# EAGLE design E-meter2 (EAGLE 7.4.0)
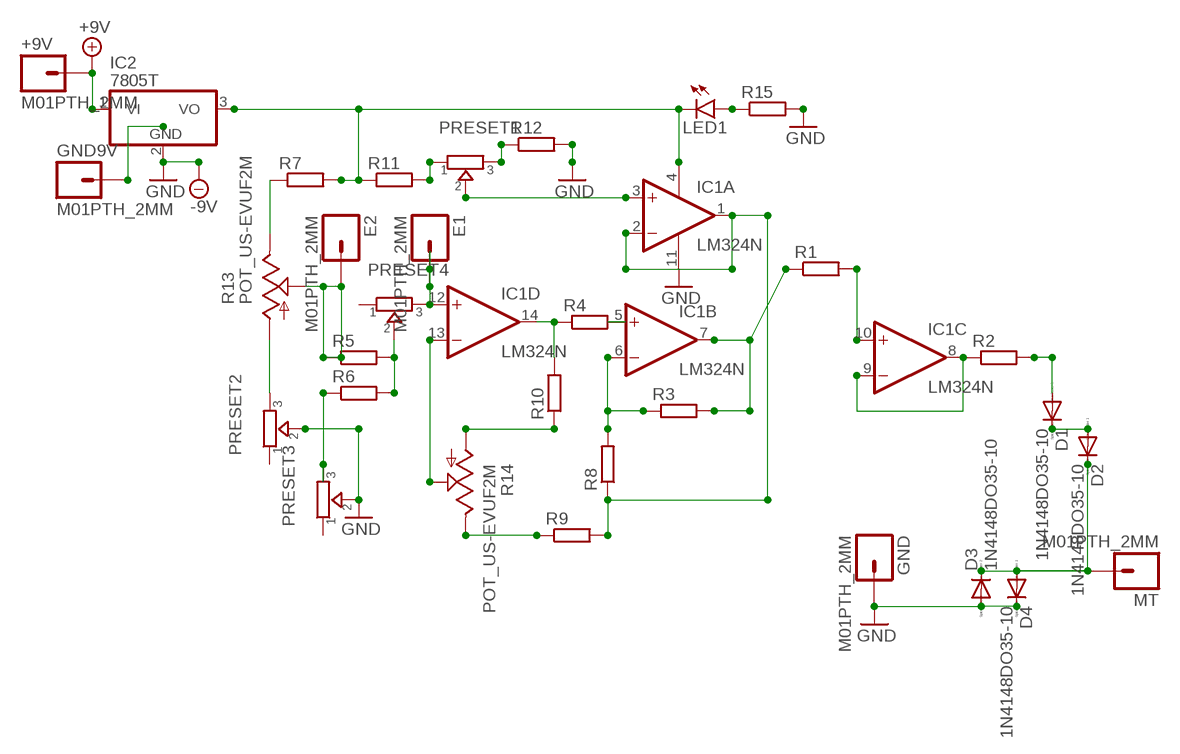
[diagram p0: schematic, sheet 1]

## Parts
+9V  M01PTH_2MM  [1X01_2MM]
D1  1N4148DO35-10  [DO35-10]
D2  1N4148DO35-10  [DO35-10]
D3  1N4148DO35-10  [DO35-10]
D4  1N4148DO35-10  [DO35-10]
E1  M01PTH_2MM  [1X01_2MM]
E2  M01PTH_2MM  [1X01_2MM]
GND  M01PTH_2MM  [1X01_2MM]
GND9V  M01PTH_2MM  [1X01_2MM]
IC1  LM324N  [DIL14]
IC2  7805T  [TO220H]
LED1  LED5MM  [LED5MM]
MT  M01PTH_2MM  [1X01_2MM]
PRESET1  TRIMMER-3306F  [TRIMMER_3306F]
PRESET2  TRIMMER-3306F  [TRIMMER_3306F]
PRESET3  TRIMMER-3306F  [TRIMMER_3306F]
PRESET4  TRIMMER-3306F  [TRIMMER_3306F]
R1  R-EU_0207/10  [0207/10]
R2  R-EU_0207/10  [0207/10]
R3  R-EU_0207/10  [0207/10]
R4  R-EU_0207/10  [0207/10]
R5  R-EU_0207/10  [0207/10]
R6  R-EU_0207/10  [0207/10]
R7  R-EU_0207/10  [0207/10]
R8  R-EU_0207/10  [0207/10]
R9  R-EU_0207/10  [0207/10]
R10  R-EU_0207/10  [0207/10]
R11  R-EU_0207/10  [0207/10]
R12  R-EU_0207/10  [0207/10]
R13  POT_US-EVUF2M  [POT_EVUFXM]
R14  POT_US-EVUF2M  [POT_EVUFXM]
R15  R-EU_0207/10  [0207/10]

## Nets
+9V: +9V.1 IC2.1(VI)
GND: D3.A D4.C GND.1 IC1.11(P:V-) IC2.2(GND) PRESET2.2 PRESET3.2 R12.2 R15.2 ; supply symbol labelled -9V
N$1: E2.1 R5.1 R13.2(S)
N$2: IC1.10(C:+IN) R1.2
N$3: IC1.6(B:-IN) R3.1 R8.2
N$4: IC1.1(A:OUT) IC1.2(A:-IN) R8.1 R9.2
N$5: IC1.5(B:+IN) R4.2
N$6: IC1.14(D:OUT) R4.1 R10.2
N$7: IC1.8(C:OUT) IC1.9(C:-IN) R2.1
N$8: D1.A R2.2
N$9: E1.1 IC1.12(D:+IN) PRESET4.3
N$10: D1.C D2.A
N$11: D2.C D3.C D4.A MT.1
N$12: IC1.3(A:+IN) PRESET1.2
N$13: PRESET1.1 R11.2
N$14: IC1.4(P:V+) IC2.3(VO) LED1.K(C) R7.2 R11.1
N$15: R7.1 R13.3(E)
N$16: PRESET1.3 R12.1
N$17: R10.1 R14.1(A)
N$18: GND9V.1
N$19: PRESET2.3 R13.1(A)
N$20: IC1.13(D:-IN) R14.2(S)
N$21: R9.1 R14.3(E)
N$22: IC1.7(B:OUT) R1.1 R3.2
N$23: PRESET4.2 R5.2 R6.2
N$24: PRESET3.3 R6.1
N$26: LED1.A R15.1
Unconnected: PRESET2.1 PRESET3.1 PRESET4.1

## Library data of the parts
+9V E1 E2 GND GND9V MT = SparkFun-Connectors:M01: Header 1 Standard 1-pin 0.1" header. Use with straight break away headers (SKU : PRT-00116), right angle break away headers (PRT-00553), swiss pins (PRT-00743), machine pins (PRT-00117), and female headers (PRT-00115).
D1-D4 = studioalgorhythmics_parts:1N4148: DIODE high speed (Philips)
IC1 = studioalgorhythmics_parts:LM324: OP AMP
IC2 = linear:78*: Positive VOLTAGE REGULATOR Source: http://cache.national.com/ds/LM/LM78L05.pdf http://www.fairchildsemi.com/ds/LM/LM7805.pdf
LED1 = studioalgorhythmics_parts:LED: LEDs Standard schematic elements and footprints for 5mm, 3mm, 1206, and 0603 sized LEDs. 5mm - Spark Fun Electronics SKU : COM-00529 (and others)
PRESET1-PRESET4 = studioalgorhythmics_parts:TRIMMER: Trimmer resistor
R1-R12 R15 = studioalgorhythmics_parts:R-EU_: RESISTOR, European symbol
R13 R14 = studioalgorhythmics_parts:POT_US-EVU: 9 mm Square Rotary Potentiometers Source: Panasonic

## Board
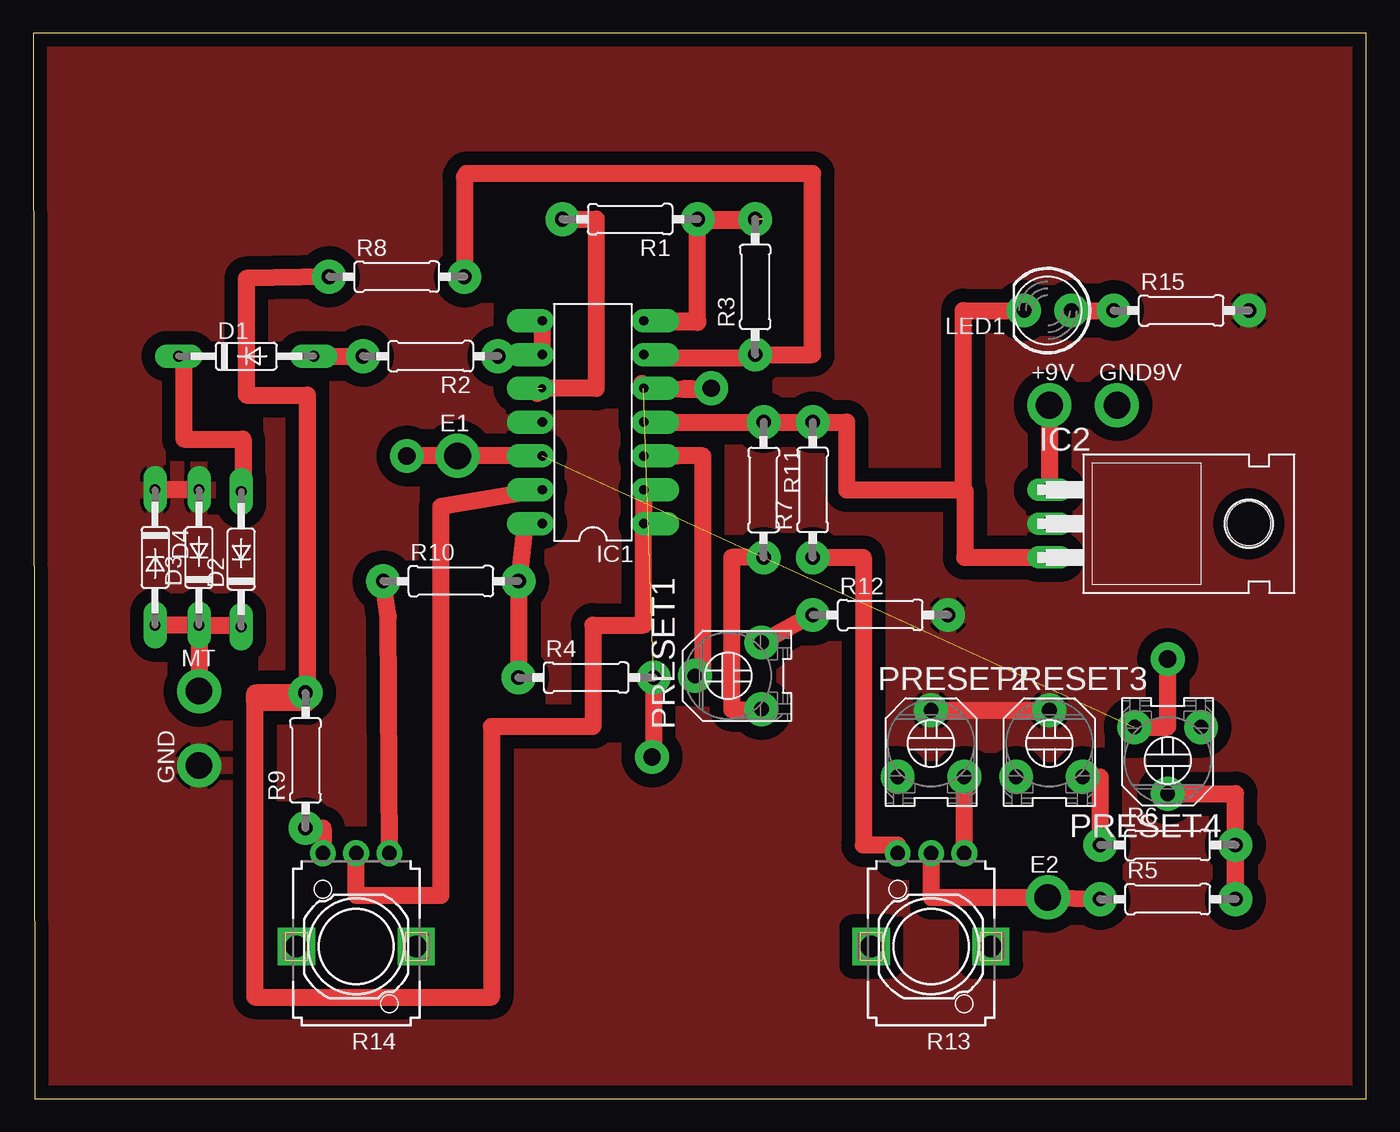
[diagram p1: board, top side]

Size 100.13 x 80 mm. Coordinates in mm from the lower left corner, seen from the top.
Outline: 0.13,0 100.13,0 100.13,80 0,80 0.13,0
Copper layers (1*16): Top 0.035mm / dielectric 1.5mm / Bottom 0.035mm
Design rules "default *": minimum track width 10mil, minimum drill 24mil, track to track 12mil, track to pad 15mil, pad to pad 12mil, via to via 15mil, smd to smd 8mil, copper to edge 40mil, drill to drill 8mil, minimum pad ring 10mil, minimum via ring 8mil, stop-mask expansion 4mil, vias tented up to drill 0mil, thermal gap 10mil

### Footprints (pad centres in the part's own frame; a part is rotated, then mirrored left to right if it is on the bottom)
1X01_2MM = drill 2 pad 3.302: 1 0,0
DO35-10 = drill 0.813 pad 1.778 long: A 5.08,0; C -5.08,0
DIL14 = drill 0.7 pad 1.778 offset: 1 -7.62,-3.81; 2 -5.08,-3.81; 3 -2.54,-3.81; 4 0,-3.81; 5 2.54,-3.81; 6 5.08,-3.81; 7 7.62,-3.81; 8 7.62,3.81; 9 5.08,3.81; 11 0,3.81; 12 -2.54,3.81; 13 -5.08,3.81; 14 -7.62,3.81 | drill 0.6 pad 1.778 offset: 10 2.54,3.81
TO220H = drill 1.118 long: 1 -2.54,-10.16; 2 0,-10.16; 3 2.54,-10.16 | hole 3.302: 0,4.826
LED5MM = drill 1.1 pad 2.54: A -1.778,0; K 1.778,0
TRIMMER_3306F = drill 1.1 pad 2.54: 1 -2.5,-2.5; 2 0,2.5; 3 2.5,-2.5
0207/10 = drill 1.1 pad 2.54: 1 -5.08,0; 2 5.08,0
POT_EVUFXM = drill 1.1 pad 1.93: 1 -2.5,-7; 2 0,-7; 3 2.5,-7 | drill 1.6 pad 2.8 square: M1 4.5,0; M2 -4.5,0

### Placement (x,y rotation side)
+9V  76.33,52.07 0 top
D1  16,55.75 0 top
D2  15.62,40.51 90 top
D3  12.45,40.64 90 top
D4  9.14,40.64 270 top
E1  31.88,48.26 0 top
E2  76.2,15.11 0 top
GND  12.45,25.02 90 top
GND9V  81.41,52.07 0 top
IC1  42.04,50.8 90 top
IC2  86.49,43.18 270 top
LED1  76.2,59.18 180 top
MT  12.45,30.61 0 top
PRESET1  52.2,31.75 90 top
PRESET2  67.44,26.67 0 top
PRESET3  76.33,26.67 0 top
PRESET4  85.22,25.4 180 top
R1  44.83,66.04 180 top
R2  29.84,55.75 180 top
R3  54.23,60.96 90 top
R4  41.53,31.62 0 top
R5  85.22,14.99 0 top
R6  85.22,19.05 0 top
R7  58.55,45.72 90 top
R8  27.3,61.72 0 top
R9  20.45,25.4 90 top
R10  31.37,38.86 0 top
R11  54.86,45.72 270 top
R12  63.63,36.32 0 top
R13  67.44,11.43 180 top
R14  24.26,11.43 180 top
R15  86.23,59.18 0 top

### Tracks (layer width: path | path; a pad name or v marks a point on that pad's centre or on a via)
+9V
  Top 1.27: +9V.1 IC2.1
GND
  Top 1.27: PRESET2.2 PRESET3.2 | D3.A D4.C | GND.1 12.83,25.02 12.83,24.77 | R15.2 91.44,59.18 91.44,59.05
  pour Top (isolate 1.016): 0.13,80.01 0.13,0 100.46,0 100.46,80.01
N$1
  Top 1.27: R5.1 E2.1 67.44,15.11 R13.2
N$2  (1 unrouted)
  Top 1.27: R1.2 42.29,66.04 42.29,53.34 37.85,53.34 37.85,52.96
N$3
  Top 1.27: IC1.6 45.97,55.88 45.97,55.63 46.36,55.63 | 46.36,55.63 46.36,55.75 | R3.1 54.74,55.88 | 54.74,55.88 58.55,55.88 58.55,69.47 32.51,69.47 32.51,69.22 32.39,69.22 R8.2 | 46.36,55.63 54.74,55.63 54.74,55.88
N$4
  Top 1.27: IC1.2 IC1.1 45.85,35.56 42.04,35.56 42.04,27.94 34.42,27.94 34.42,7.62 16.64,7.62 16.64,29.72 | R8.1 16,61.59 16,52.83 20.57,52.83 20.57,29.72 16.76,29.72 | 16.76,29.72 16.64,29.72 | 16.64,29.72 16.64,30.48 | R9.2 16.76,30.48 16.76,29.72
N$5  (1 unrouted)
  Top 1.27: R4.2 46.61,25.4 | 45.72,53.72 IC1.5 51.56,53.21 48.9,53.34
N$6
  Top 1.27: IC1.14 36.96,43.18 R10.2 R4.1
N$7
  Top 1.27: IC1.8 IC1.9 R2.1
N$8
  Top 1.27: D1.A R2.2
N$9  (1 unrouted)
  Top 1.27: E1.1 IC1.12 28.07,48.26 | PRESET4.3 85.22,27.9 85.22,33.02
N$10  (1 unrouted)
  Top 1.27: D1.C 11.3,55.75 11.3,49.53 15.75,49.53 15.75,44.96
N$11
  Top 1.27: D3.C 15.37,35.56 D2.C | D3.C MT.1 | D3.C D4.A
N$12
  Top 1.27: 48.39,48.26 IC1.3 50.29,48.26 50.29,31.75 PRESET1.2
N$13
  Top 1.27: R11.2 52.45,40.64 52.45,29.21 54.7,29.21 PRESET1.1
N$14
  Top 1.27: 69.85,45.72 61.09,45.72 61.09,50.8 R7.2 R11.1 IC1.4 | IC2.3 69.98,40.64 69.98,45.72 69.85,45.72 | 69.85,45.72 69.85,59.18 LED1.K
N$15
  Top 1.27: R7.1 62.36,40.64 62.36,19.05 64.94,19.05 R13.3
N$16
  Top 1.27: R12.1 PRESET1.3
N$17
  Top 1.27: R14.1 26.67,36.21 R10.1
N$19
  Top 1.27: R13.1 PRESET2.3
N$20
  Top 1.27: IC1.13 30.61,44.45 30.61,15.24 24.26,15.24 R14.2
N$21
  Top 1.27: R9.1 21.76,20.32 R14.3
N$22  (1 unrouted)
  Top 1.27: R1.1 54.86,66.04 54.86,65.91 50.04,65.91 | 49.91,65.91 49.66,65.91 49.66,66.04 R1.1 | R1.1 49.91,66.17 50.04,66.17 50.04,65.91 | 50.04,65.91 49.91,65.91 | 49.91,65.91 49.91,65.28 49.91,58.42 | 49.91,58.42 49.91,58.29 46.48,58.29 | 45.72,58.42 IC1.7 49.91,58.42
N$23
  Top 1.27: R6.2 R5.2 90.3,22.9 PRESET4.2
N$24
  Top 1.27: PRESET3.3 80.14,24.17 R6.1
N$26
  Top 1.27: LED1.A R15.1
N$28  (via drill 1.3 pad 2.54)
  other vias: 50.93,53.34
N$29  (via drill 1.3 pad 2.54)
  other vias: 46.48,25.65
N$30  (via drill 1.3 pad 2.54)
  other vias: 28.07,48.26
N$31  (via drill 1.3 pad 2.54)
  other vias: 85.22,33.02